# EAGLE design Diagnostic (EAGLE 9.5.0)

## Sheet 1 of 3: Microcontroller
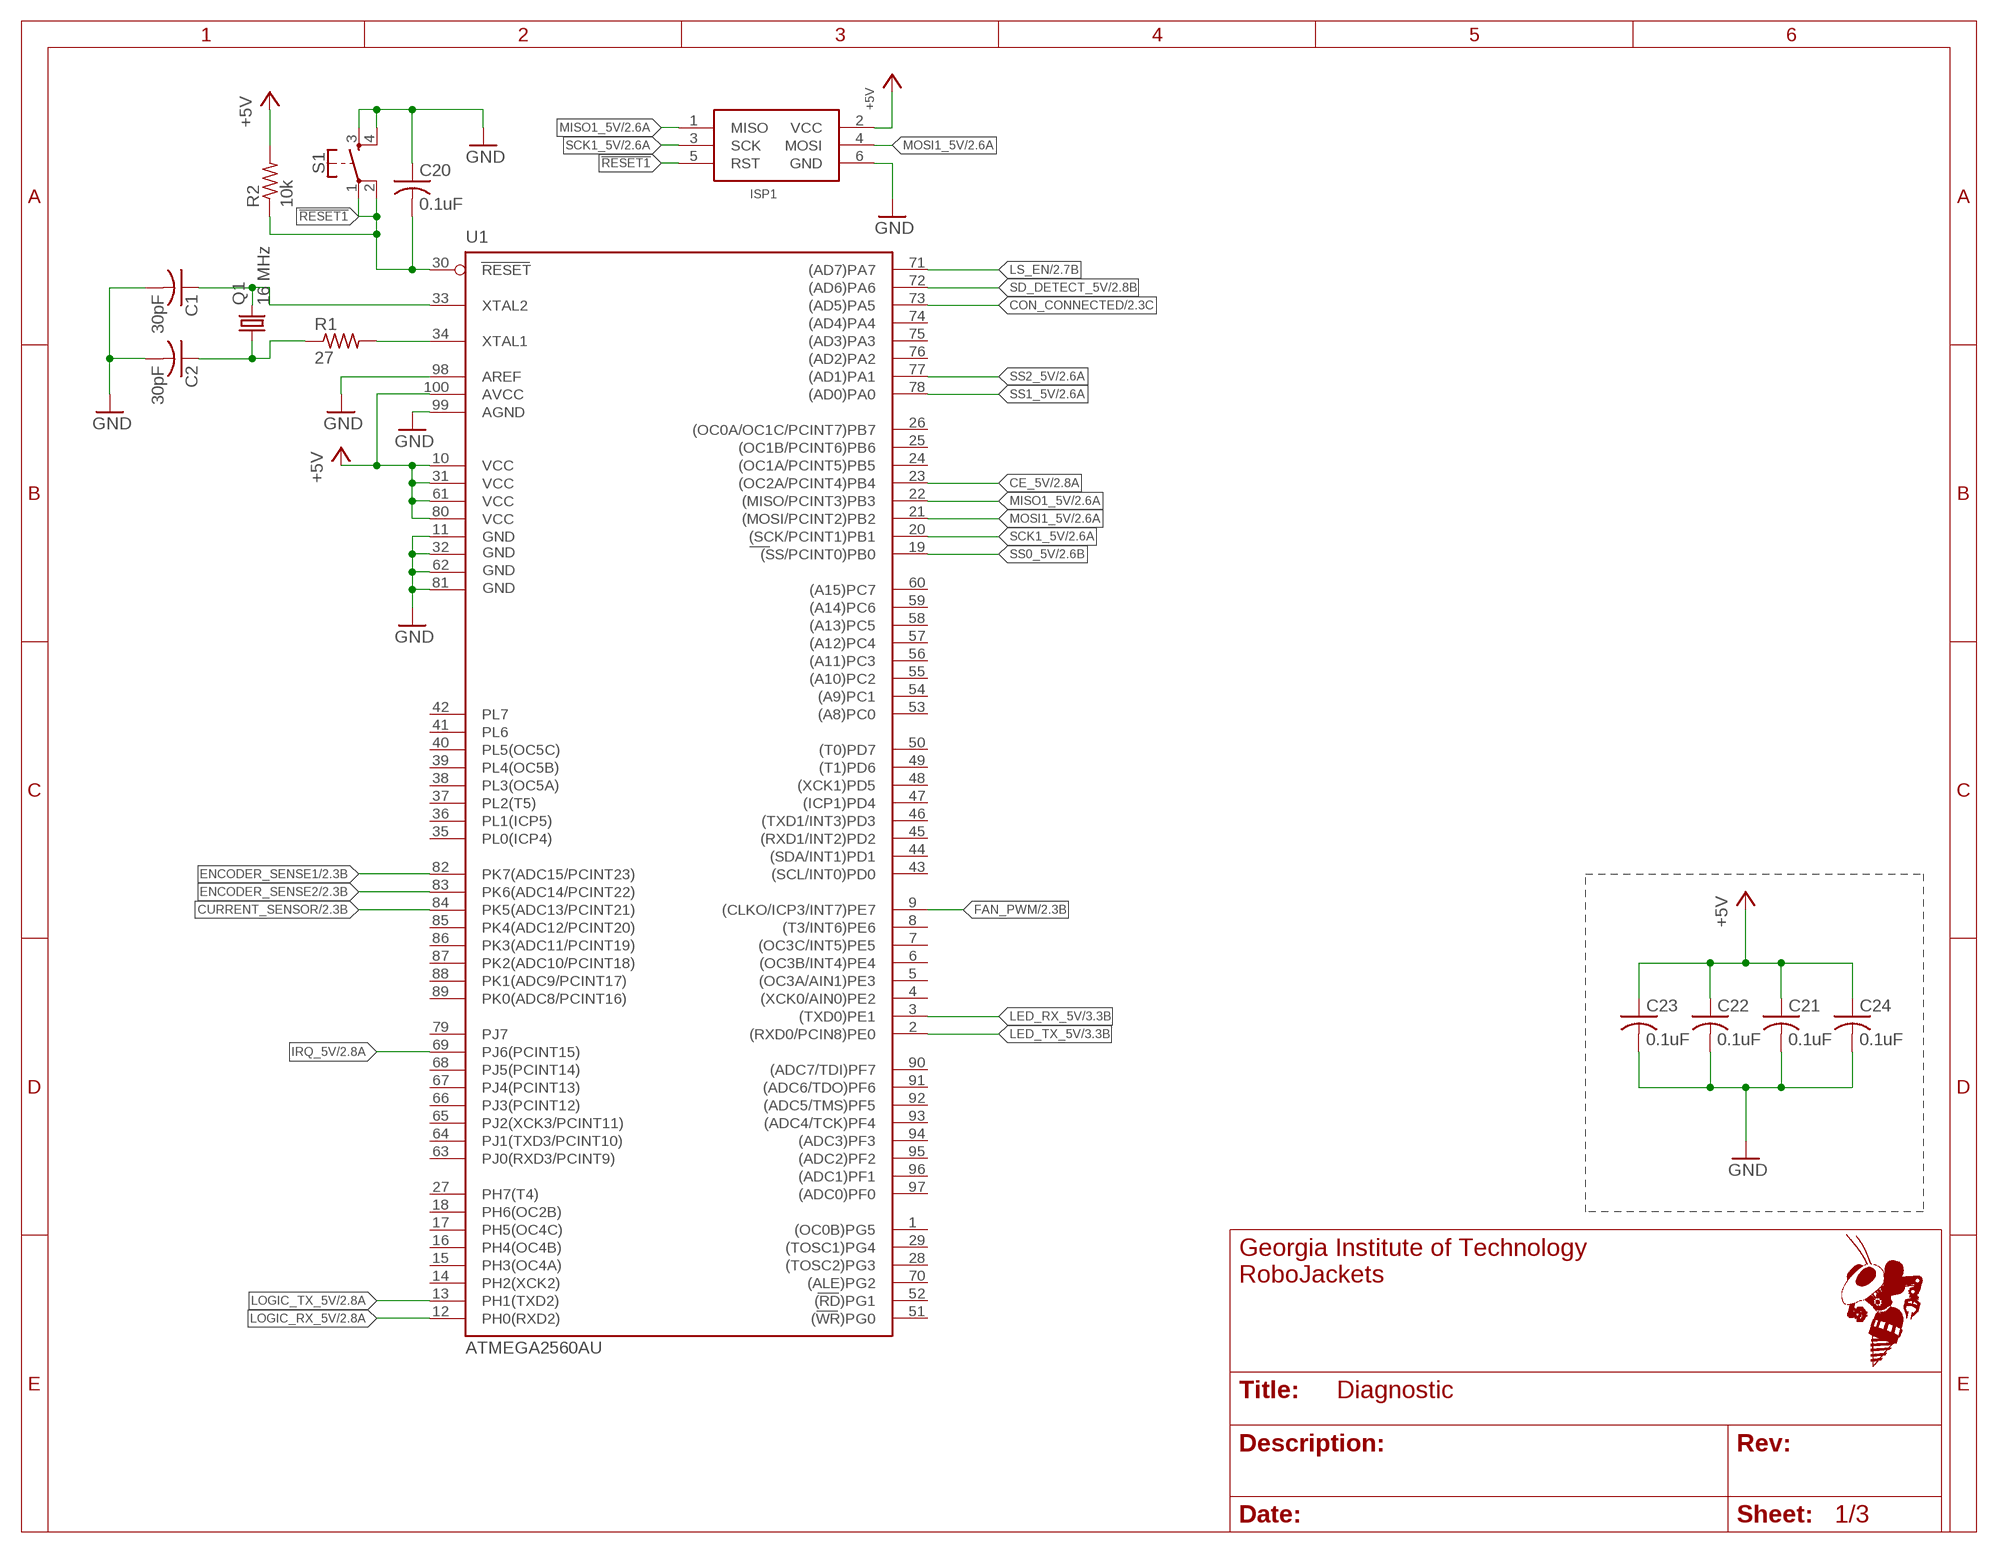
[diagram p0: schematic, sheet 1]

### Parts
C1  30pF  C-USC0603  [C0603]
C2  30pF  C-USC0603  [C0603]
C20  0.1uF  C-USC0603  [C0603]
C21  0.1uF  C-USC0603  [C0603]
C22  0.1uF  C-USC0603  [C0603]
C23  0.1uF  C-USC0603  [C0603]
C24  0.1uF  C-USC0603  [C0603]
ISP1  AVRISP-6  [AVRISP]
Q1  16 MHz  CRYSTALHC49UP  [HC49UP]
R1  27  R-US_R0603  [R0603]
R2  10k  R-US_R0603  [R0603]
S1  MOMENTARY-SWITCH-SPST-2-SMD-5.2MM  [TACTILE_SWITCH_SMD_5.2MM]
U1  ATMEGA2560AU  [TQFP100]

### Nets
!RESET1: C20.2 ISP1.5(RST) R2.1 S1.1 S1.2 U1.30(RESET)
+5V: C21.1 C22.1 C23.1 C24.1 ISP1.2(VCC) R2.2 U1.10(VCC) U1.31(VCC1) U1.61(VCC2) U1.80(VCC3) U1.100(AVCC) ; also sheet 2,3
CE_5V: U1.23((OC2A/PCINT4)PB4) ; also sheet 2
CON_CONNECTED: U1.73((AD5)PA5) ; also sheet 2
CURRENT_SENSOR: U1.84(PK5(ADC13/PCINT21)) ; also sheet 2
ENCODER_SENSE1: U1.82(PK7(ADC15/PCINT23)) ; also sheet 2
ENCODER_SENSE2: U1.83(PK6(ADC14/PCINT22)) ; also sheet 2
FAN_PWM: U1.9((CLKO/ICP3/INT7)PE7) ; also sheet 2
GND: C1.2 C2.2 C20.1 C21.2 C22.2 C23.2 C24.2 ISP1.6(GND) S1.3 S1.4 U1.11(GND) U1.32(GND1) U1.62(GND2) U1.81(GND3) U1.98(AREF) U1.99(AGND) ; also sheet 2,3
IRQ_5V: U1.69(PJ6(PCINT15)) ; also sheet 2
LED_RX_5V: U1.3((TXD0)PE1) ; also sheet 3
LED_TX_5V: U1.2((RXD0/PCIN8)PE0) ; also sheet 3
LOGIC_RX_5V: U1.12(PH0(RXD2)) ; also sheet 2
LOGIC_TX_5V: U1.13(PH1(TXD2)) ; also sheet 2
LS_EN: U1.71((AD7)PA7) ; also sheet 2
MISO1_5V: ISP1.1(MISO) U1.22((MISO/PCINT3)PB3) ; also sheet 2
MOSI1_5V: ISP1.4(MOSI) U1.21((MOSI/PCINT2)PB2) ; also sheet 2
N$1: C2.1 Q1.1 R1.1
N$2: C1.1 Q1.2 U1.33(XTAL2)
N$3: R1.2 U1.34(XTAL1)
SCK1_5V: ISP1.3(SCK) U1.20((SCK/PCINT1)PB1) ; also sheet 2
SD_DETECT_5V: U1.72((AD6)PA6) ; also sheet 2
SS0_5V: U1.19((SS/PCINT0)PB0) ; also sheet 2
SS1_5V: U1.78((AD0)PA0) ; also sheet 2
SS2_5V: U1.77((AD1)PA1) ; also sheet 2
Unconnected: U1.1((OC0B)PG5) U1.4((XCK0/AIN0)PE2) U1.5((OC3A/AIN1)PE3) U1.6((OC3B/INT4)PE4) U1.7((OC3C/INT5)PE5) U1.8((T3/INT6)PE6) U1.14(PH2(XCK2)) U1.15(PH3(OC4A)) U1.16(PH4(OC4B)) U1.17(PH5(OC4C)) U1.18(PH6(OC2B)) U1.24((OC1A/PCINT5)PB5) U1.25((OC1B/PCINT6)PB6) U1.26((OC0A/OC1C/PCINT7)PB7) U1.27(PH7(T4)) U1.28((TOSC2)PG3) U1.29((TOSC1)PG4) U1.35(PL0(ICP4)) U1.36(PL1(ICP5)) U1.37(PL2(T5)) U1.38(PL3(OC5A)) U1.39(PL4(OC5B)) U1.40(PL5(OC5C)) U1.41(PL6) U1.42(PL7) U1.43((SCL/INT0)PD0) U1.44((SDA/INT1)PD1) U1.45((RXD1/INT2)PD2) U1.46((TXD1/INT3)PD3) U1.47((ICP1)PD4) U1.48((XCK1)PD5) U1.49((T1)PD6) U1.50((T0)PD7) U1.51((WR)PG0) U1.52((RD)PG1) U1.53((A8)PC0) U1.54((A9)PC1) U1.55((A10)PC2) U1.56((A11)PC3) U1.57((A12)PC4) U1.58((A13)PC5) U1.59((A14)PC6) U1.60((A15)PC7) U1.63(PJ0(RXD3/PCINT9)) U1.64(PJ1(TXD3/PCINT10)) U1.65(PJ2(XCK3/PCINT11)) U1.66(PJ3(PCINT12)) U1.67(PJ4(PCINT13)) U1.68(PJ5(PCINT14)) U1.70((ALE)PG2) U1.74((AD4)PA4) U1.75((AD3)PA3) U1.76((AD2)PA2) U1.79(PJ7) U1.85(PK4(ADC12/PCINT20)) U1.86(PK3(ADC11/PCINT19)) U1.87(PK2(ADC10/PCINT18)) U1.88(PK1(ADC9/PCINT17)) U1.89(PK0(ADC8/PCINT16)) U1.90((ADC7/TDI)PF7) U1.91((ADC6/TDO)PF6) U1.92((ADC5/TMS)PF5) U1.93((ADC4/TCK)PF4) U1.94((ADC3)PF3) U1.95((ADC2)PF2) U1.96((ADC1)PF1) U1.97((ADC0)PF0)

## Sheet 2 of 3: Connectors
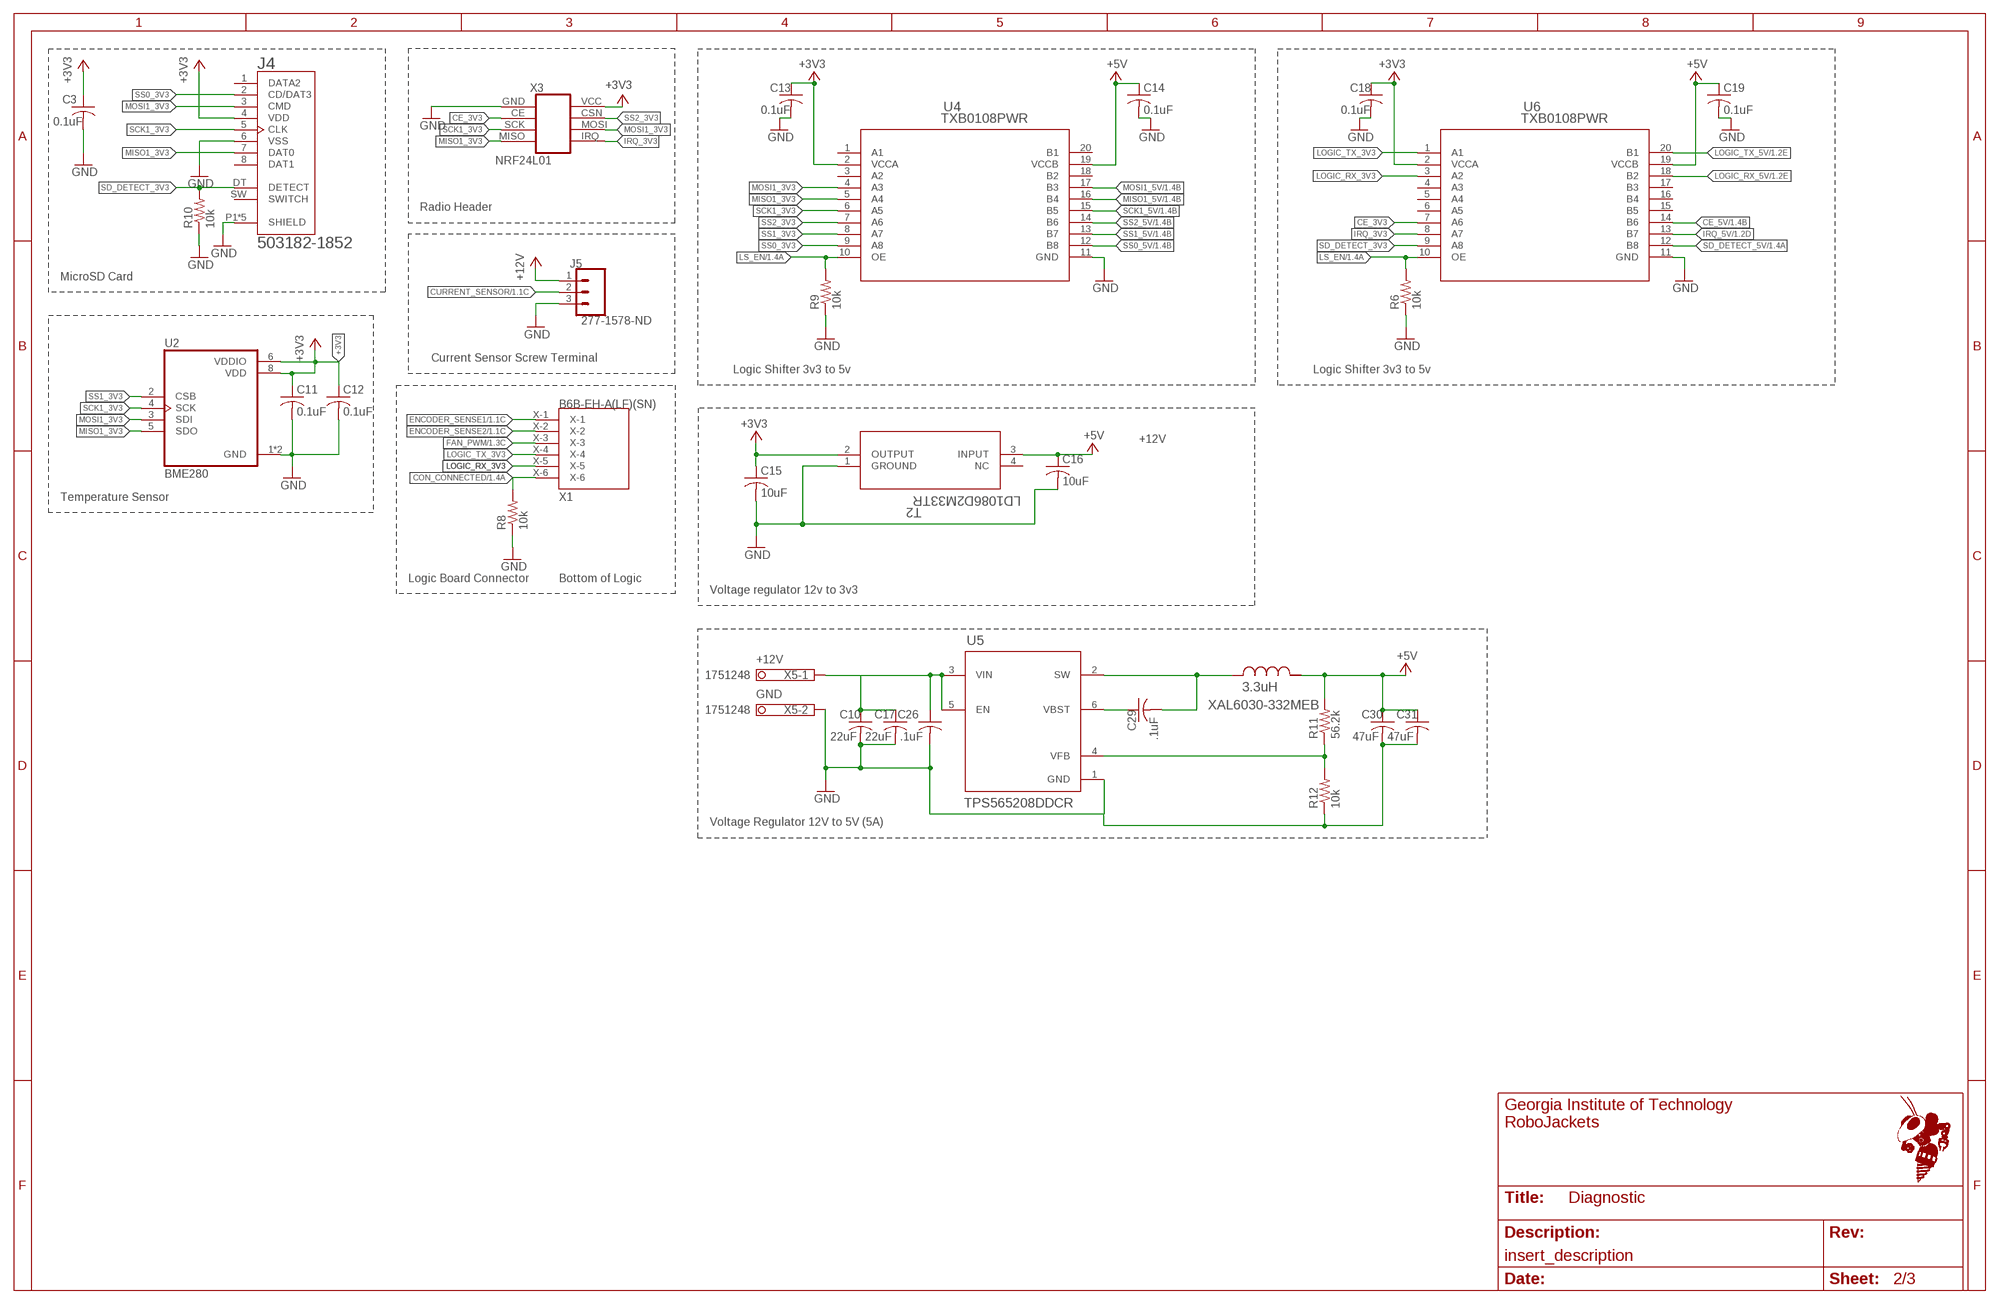
[diagram p1: schematic, sheet 2]
FRAME4 (FRAME_B_L): SCH_DESC: insert_description

### Parts
C3  0.1uF  C-USC0603  [C0603]
C10  22uF  C-USC0603  [C0603]
C11  0.1uF  C-USC0603  [C0603]
C12  0.1uF  C-USC0603  [C0603]
C13  0.1uF  C-USC0603  [C0603]
C14  0.1uF  C-USC0603  [C0603]
C15  10uF  C-USC1206  [C1206]
C16  10uF  C-USC1206  [C1206]
C17  22uF  C-USC0603  [C0603]
C18  0.1uF  C-USC0603  [C0603]
C19  0.1uF  C-USC0603  [C0603]
C26  .1uF  C-USC0603  [C0603]
C29  .1uF  C-USC0603  [C0603]
C30  47uF  C-USC0603  [C0603]
C31  47uF  C-USC0603  [C0603]
J4  503182-1852  [MOLEX_503182-1852]
J5  277-1578-ND  CONN_03-SCREW-5MM  [SCREWTERMINAL-5MM-3]
R6  10k  R-US_R0603  [R0603]
R8  10k  R-US_R0603  [R0603]
R9  10k  R-US_R0603  [R0603]
R10  10k  R-US_R0603  [R0603]
R11  56.2k  R-US_R0603  [R0603]
R12  10k  R-US_R0603  [R0603]
T2  LD1086D2M33TR  [D2PAK/A]
U2  BME280  [PSON65P250X250X100-8N]
U4  TXB0108PWR  [PW20]
U5  TPS565208DDCR  [DDC0006A_N]
U6  TXB0108PWR  [PW20]
X1  B6B-EH-A(LF)(SN)  [B6BEHALFSN]
X3  NRF24L01  NRF24L01+PA+LNA  [NRF24L01+PA+LNA]
X5  1751248  [1751248]
XAL6030-332MEB  3.3uH  XAL6030-332MEB  [XAL6030]

### Nets
+3.3V: X3.VCC ; supply symbol labelled +3V3
+3V3: C3.1 C11.1 C12.1 C13.1 C15.1 C18.1 J4.4(VDD) T2.2(OUTPUT) U2.6(VDDIO) U2.8(VDD) U4.2(VCCA) U6.2(VCCA)
+5V: C14.1 C16.1 C19.1 C30.1 C31.1 R11.2 T2.3(INPUT) U4.19(VCCB) U6.19(VCCB) XAL6030-332MEB.2 ; also sheet 1,3
+12V: C10.1 C17.1 C26.1 J5.1 U5.3(VIN) U5.5(EN) X5.1
CE_3V3: U6.7(A6) X3.CE
CE_5V: U6.14(B6) ; also sheet 1
CON_CONNECTED: R8.2 X1.X-6 ; also sheet 1
CURRENT_SENSOR: J5.2 ; also sheet 1
ENCODER_SENSE1: X1.X-1 ; also sheet 1
ENCODER_SENSE2: X1.X-2 ; also sheet 1
FAN_PWM: X1.X-3 ; also sheet 1
GND: C3.2 C10.2 C11.2 C12.2 C13.2 C14.2 C15.2 C16.2 C17.2 C18.2 C19.2 C26.2 C30.2 C31.2 J4.6(VSS) J4.P1(SHIELD) J4.P2(SHIELD) J4.P3(SHIELD) J4.P4(SHIELD) J4.P5(SHIELD) J5.3 R6.1 R8.1 R9.1 R10.1 R12.1 T2.1(GROUND) U2.1(GND) U2.7(GND) U4.11(GND) U5.1(GND) U6.11(GND) X3.GND X5.2 ; also sheet 1,3
IRQ_3V3: U6.8(A7) X3.IRQ
IRQ_5V: U6.13(B7) ; also sheet 1
LOGIC_RX_3V3: U6.3(A2) X1.X-5
LOGIC_RX_5V: U6.18(B2) ; also sheet 1
LOGIC_TX_3V3: U6.1(A1) X1.X-4
LOGIC_TX_5V: U6.20(B1) ; also sheet 1
LS_EN: R6.2 R9.2 U4.10(OE) U6.10(OE) ; also sheet 1
MISO1_3V3: J4.7(DAT0) U2.5(SDO) U4.5(A4) X3.MISO
MISO1_5V: U4.16(B4) ; also sheet 1
MOSI1_3V3: J4.3(CMD) U2.3(SDI) U4.4(A3) X3.MOSI
MOSI1_5V: U4.17(B3) ; also sheet 1
N$7: C29.2 U5.2(SW) XAL6030-332MEB.1
N$8: C29.1 U5.6(VBST)
N$9: R11.1 R12.2 U5.4(VFB)
SCK1_3V3: J4.5(CLK) U2.4(SCK) U4.6(A5) X3.SCK
SCK1_5V: U4.15(B5) ; also sheet 1
SD_DETECT_3V3: J4.DT(DETECT) R10.2 U6.9(A8)
SD_DETECT_5V: U6.12(B8) ; also sheet 1
SS0_3V3: J4.2(CD/DAT3) U4.9(A8)
SS0_5V: U4.12(B8) ; also sheet 1
SS1_3V3: U2.2(CSB) U4.8(A7)
SS1_5V: U4.13(B7) ; also sheet 1
SS2_3V3: U4.7(A6) X3.CSN
SS2_5V: U4.14(B6) ; also sheet 1
Unconnected: J4.1(DATA2) J4.8(DAT1) J4.SW(SWITCH) T2.4(NC) U4.1(A1) U4.3(A2) U4.18(B2) U4.20(B1) U6.4(A3) U6.5(A4) U6.6(A5) U6.15(B5) U6.16(B4) U6.17(B3)

### Notes on the sheet
- Radio Header
- MicroSD Card
- Current Sensor Screw Terminal
- Logic Shifter 3v3 to 5v | Logic Shifter 3v3 to 5v
- +12V
- Temperature Sensor
- Logic Board Connector | Bottom of Logic
- Voltage regulator 12v to 3v3
- +12V
- GND
- Voltage Regulator 12V to 5V (5A)

## Sheet 3 of 3: Neopixel
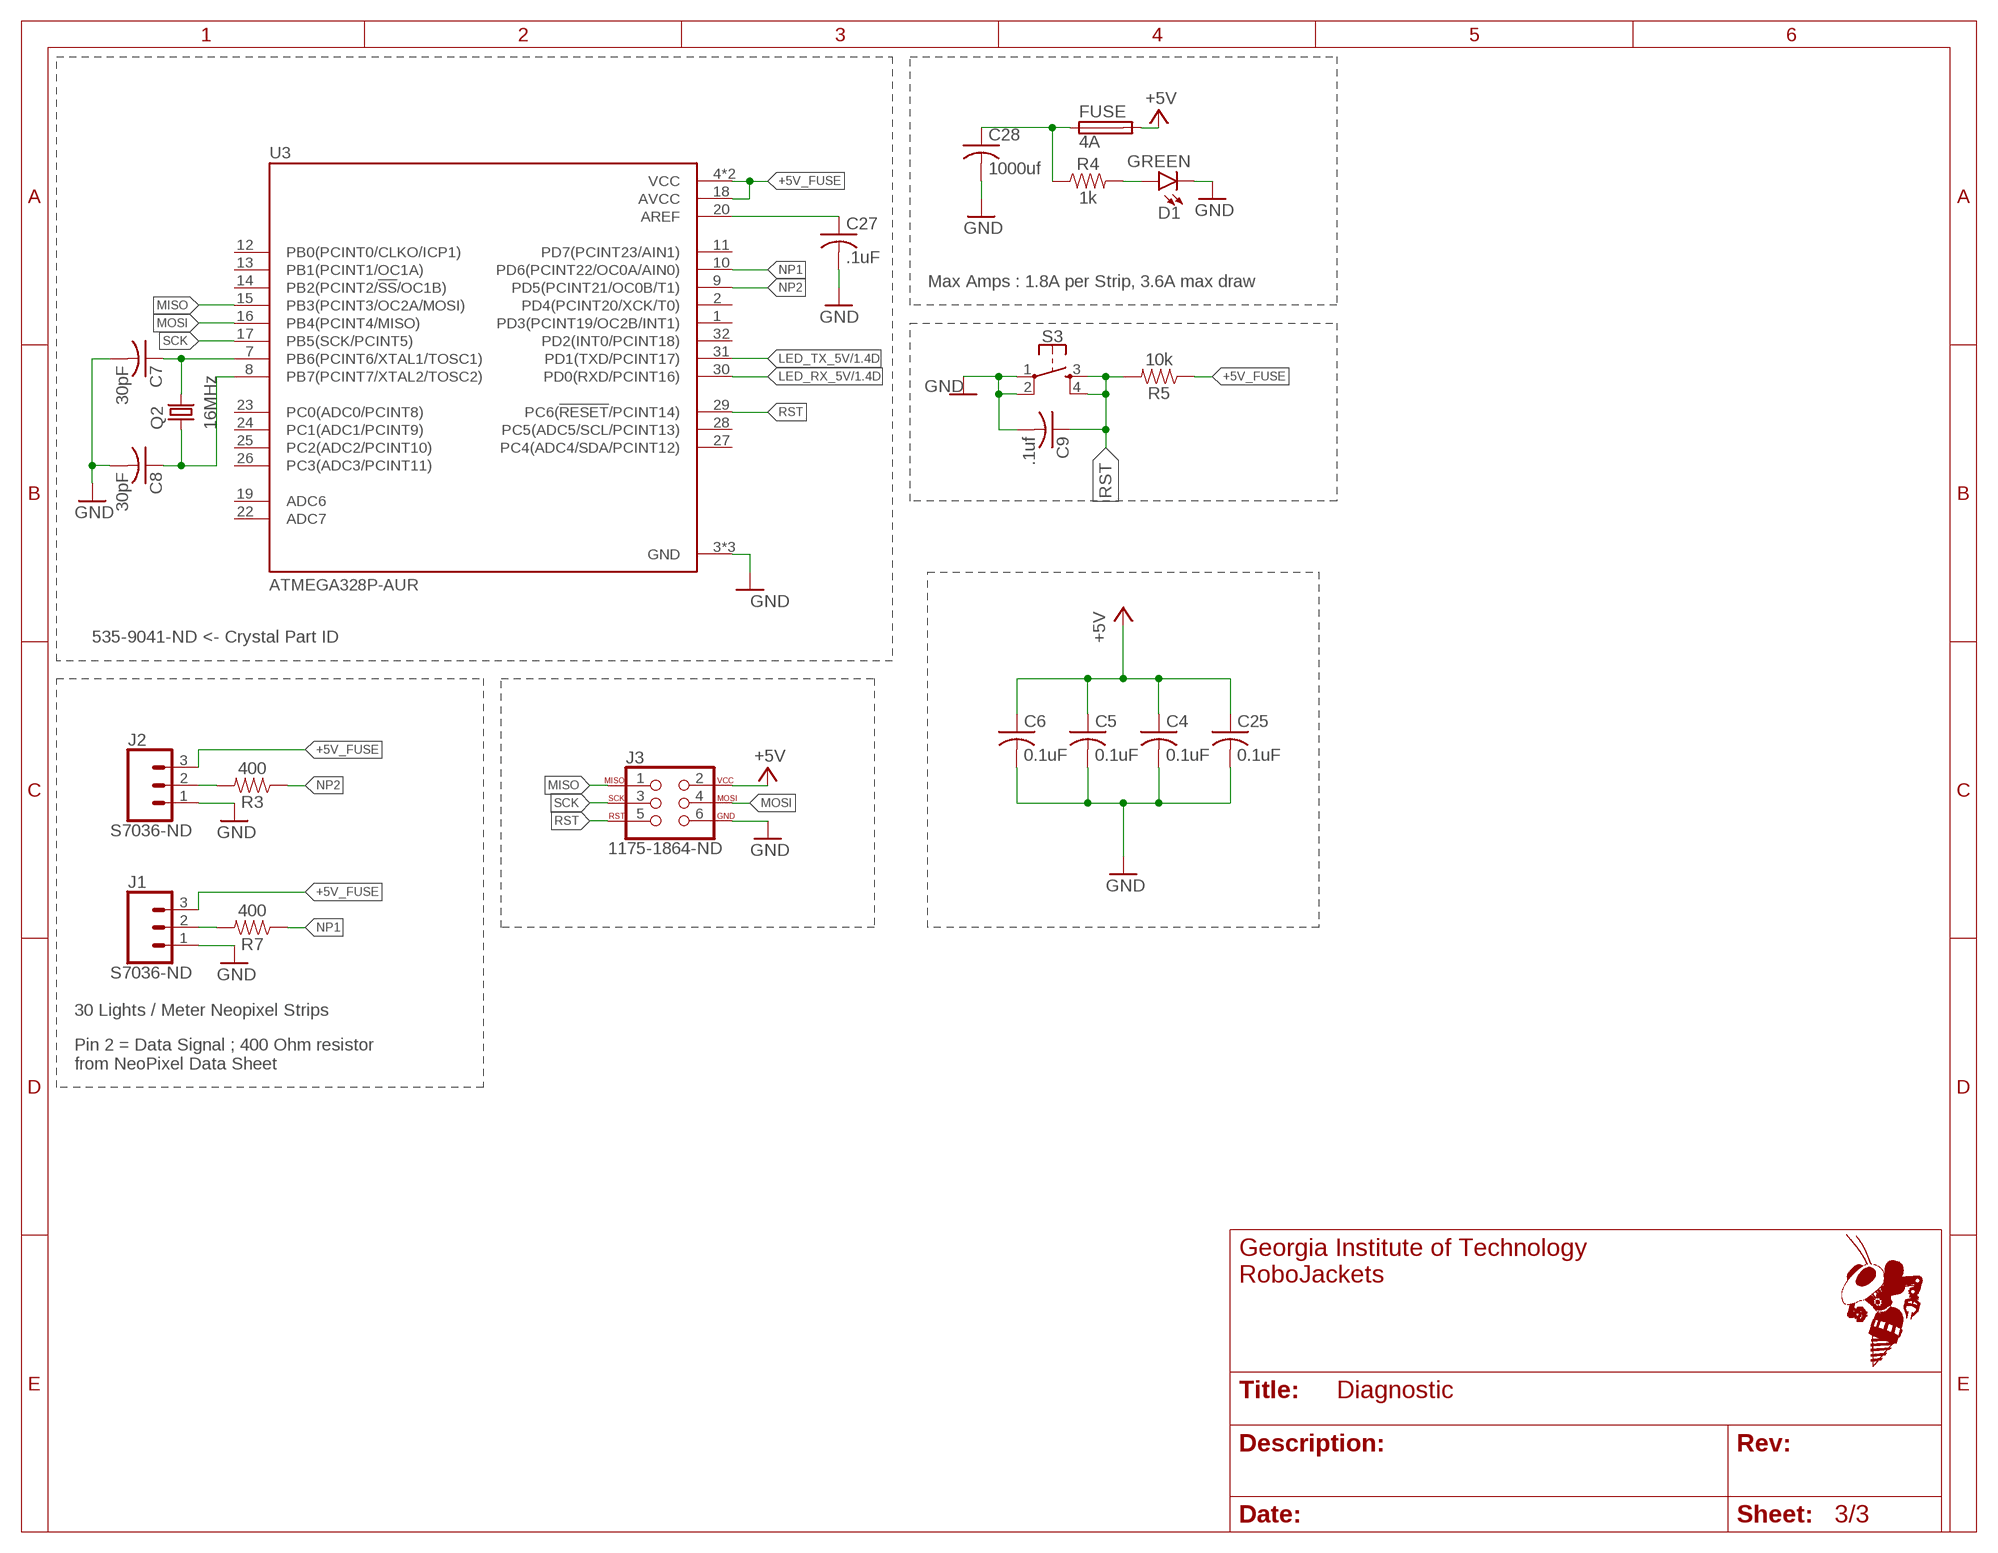
[diagram p2: schematic, sheet 3]

### Parts
C4  0.1uF  C-USC0603  [C0603]
C5  0.1uF  C-USC0603  [C0603]
C6  0.1uF  C-USC0603  [C0603]
C7  30pF  C-USC0603  [C0603]
C8  30pF  C-USC0603  [C0603]
C9  .1uf  C-USC0603  [C0603]
C25  0.1uF  C-USC0603  [C0603]
C27  .1uF  C-USC0603  [C0603]
C28  1000uf  C-USC0603  [C0603]
D1  GREEN  LED-GREEN0603  [LED-0603]
FUSE  4A  FUSE_HOLDER  [FUSE_HOLDER]
J1  S7036-ND  CONN_03  [1X03]
J2  S7036-ND  CONN_03  [1X03]
J3  1175-1864-ND  AVR_SPI_PROG_3X2NS  [2X3-NS]
Q2  16MHz  CRYSTALHC49S  [HC49/S]
R3  400  470OHM-0603-1/10W-1%  [0603]
R4  1k  470OHM-0603-1/10W-1%  [0603]
R5  10k  470OHM-0603-1/10W-1%  [0603]
R7  400  470OHM-0603-1/10W-1%  [0603]
S3  MOMENTARY-SWITCH-SPST-2-SMD-5.2MM  [TACTILE_SWITCH_SMD_5.2MM]
U3  ATMEGA328P-AUR  [QFP32P80_900X900X120L60X37N]

### Nets
+5V: C4.1 C5.1 C6.1 C25.1 FUSE.P$3 FUSE.P$4 J3.2 ; also sheet 1,2
+5V_FUSE: C28.1 FUSE.P$1 FUSE.P$2 J1.3 J2.3 R4.1 R5.1 U3.4(VCC) U3.6(VCC) U3.18(AVCC)
DATA3: J2.2 R3.2
DATA4: J1.2 R7.2
GND: C4.2 C5.2 C6.2 C7.2 C8.2 C9.2 C25.2 C27.2 C28.2 D1.C J1.1 J2.1 J3.6 S3.1 S3.2 U3.3(GND) U3.5(GND) U3.21(GND) ; also sheet 1,2
LED_RX_5V: U3.30(PD0(RXD/PCINT16)) ; also sheet 1
LED_TX_5V: U3.31(PD1(TXD/PCINT17)) ; also sheet 1
MISO: J3.1 U3.15(PB3(PCINT3/OC2A/MOSI))
MOSI: J3.4 U3.16(PB4(PCINT4/MISO))
N$4: D1.A R4.2
N$23: C27.1 U3.20(AREF)
NP1: R7.1 U3.10(PD6(PCINT22/OC0A/AIN0))
NP2: R3.1 U3.9(PD5(PCINT21/OC0B/T1))
RST: C9.1 J3.5 R5.2 S3.3 S3.4 U3.29(PC6(!RESET!/PCINT14))
SCK: J3.3 U3.17(PB5(SCK/PCINT5))
XTAL3: C7.1 Q2.2 U3.7(PB6(PCINT6/XTAL1/TOSC1))
XTAL4: C8.1 Q2.1 U3.8(PB7(PCINT7/XTAL2/TOSC2))
Unconnected: U3.1(PD3(PCINT19/OC2B/INT1)) U3.2(PD4(PCINT20/XCK/T0)) U3.11(PD7(PCINT23/AIN1)) U3.12(PB0(PCINT0/CLKO/ICP1)) U3.13(PB1(PCINT1/OC1A)) U3.14(PB2(PCINT2/!SS!/OC1B)) U3.19(ADC6) U3.22(ADC7) U3.23(PC0(ADC0/PCINT8)) U3.24(PC1(ADC1/PCINT9)) U3.25(PC2(ADC2/PCINT10)) U3.26(PC3(ADC3/PCINT11)) U3.27(PC4(ADC4/SDA/PCINT12)) U3.28(PC5(ADC5/SCL/PCINT13)) U3.32(PD2(INT0/PCINT18))

### Notes on the sheet
- Max Amps : 1.8A per Strip, 3.6A max draw
- 535-9041-ND <- Crystal Part ID
- 30 Lights / Meter Neopixel Strips
- Pin 2 = Data Signal ; 400 Ohm resistor 
  from NeoPixel Data Sheet

## Library data of the parts
C1-C31 = rcl:C-US: CAPACITOR, American symbol; SPICEPREFIX: C
D1 = SparkFun-LED:LED-GREEN: Green SMD LED Used in manufacturing of various products at SparkFun Packages: 0603 - SMD 0603 package [Product Link] <http://www.futureelectronics.com/en/technologies/semiconductors/optoelectronics/leds/Pages/9894312-LTST-C190GKT.aspx?CrossPart=HSMG-C190&IM=0> LilyPad 1206 - SMD1206 LilyPad package [Product Link] <http://www.futureelectronics.com/en/Technologies/Product.aspx?ProductID=IN150NGHARVATEKCORPORATION2049943&IM=0> 1206 - SMD1206 package [Product Link] <http://www.futureelectronics.com/en/technologies/semiconductors/optoelectronics/leds/Pages/8315665-LTST-C150KGKT.aspx?IM=0> 1206 Bottom Mount -SMD 1206 Bottom Mount [Product Link] <http://www.digikey.com/product-detail/en/lite-on-inc/LTST-C230KGKT/160-1456-1-ND/386854> SparkFun Products: Pro Mini 328 -5V <https://www.sparkfun.com/products/821> RedBoard <https://www.sparkfun.com/products/12757> MP3 Trigger <https://www.sparkfun.com/products/13720> Makey Makey <https://www.sparkfun.com/products/11076>; PROD_ID: DIO-00821
FUSE = IGVC-Misc:FUSE_HOLDER
ISP1 = adafruit:AVRISP: AVR ISP HEADER Standard 6 pin header for AVR programming
J1 J2 = SparkFun-Connectors:CONN_03: Multi connection point. Often used as Generic Header-pin footprint for 0.1 inch spaced/style header connections On any of the 0.1 inch spaced packages, you can populate with these: Break Away Headers - Straight <https://www.sparkfun.com/products/116> (PRT-00116) Break Away Male Headers - Right Angle <https://www.sparkfun.com/products/553> (PRT-00553) Female Headers <https://www.sparkfun.com/products/115> (PRT-00115) Break Away Headers - Machine Pin <https://www.sparkfun.com/products/117> (PRT-00117) Break Away Female Headers - Swiss Machine Pin <https://www.sparkfun.com/products/743> (PRT-00743) Stackable Header - 3 Pin (Female, 0.1") <https://www.sparkfun.com/products/13875> (PRT-13875) For SCREWTERMINALS and SPRING TERMINALS visit here: Screw Terimnals on SparkFun.com <https://www.sparkfun.com/search/results?term=Screw+Terminals> (5mm/3.5mm/2.54mm spacing) This device is also useful as a general connection point to wire up your design to another part of your project. Our various solder wires solder well into these plated through hole pads. Hook-Up Wire - Assortment (Stranded, 22 AWG) <https://www.sparkfun.com/products/11375> (PRT-11375) Hook-Up Wire - Assortment (Solid Core, 22 AWG) <https://www.sparkfun.com/products/11367> (PRT-11367) View the entire wire category on our website here <https://www.sparkfun.com/categories/141> Special notes: Molex polarized connector foot print use with SKU : PRT-08232 with associated crimp pins and housings.; SPICEPREFIX: J
J3 = SparkFun-Connectors:AVR_SPI_PROG_3X2: AVR ISP 6 Pin This is the reduced ISP connector for AVR programming. Common on Arduino. This footprint will take up less PCB space and can be used with a 10-pin to 6-pin adapter such as SKU: BOB-08508 **Special note about "TEST_POINT" package. The stop mask is on the top side, so if you want your programming test points to be on the bottom of your board, make sure to place this package on the bottom side of the board. This also ensure that the orientation to program from the bottom side will be correct. SparkFun Products: SparkFun ISP Pogo Adapter <https://www.sparkfun.com/products/11591> - NS Tiny AVR Programmer <https://www.sparkfun.com/products/11801> -PTH
J4 = 503182-1852:503182-1852: Conn Micro SD Card M 8 POS 1.09mm Solder RA SMD Embossed T/R 0.5A/Contact; AVAILABILITY: Unavailable; DESCRIPTION: MICRO SD NORMAL ULTRALOWPRO8CKTE; MF: Molex; MP: 5031821852; PACKAGE: None; PRICE: None
J5 = SparkFun-Connectors:CONN_03: Multi connection point. Often used as Generic Header-pin footprint for 0.1 inch spaced/style header connections On any of the 0.1 inch spaced packages, you can populate with these: Break Away Headers - Straight <https://www.sparkfun.com/products/116> (PRT-00116) Break Away Male Headers - Right Angle <https://www.sparkfun.com/products/553> (PRT-00553) Female Headers <https://www.sparkfun.com/products/115> (PRT-00115) Break Away Headers - Machine Pin <https://www.sparkfun.com/products/117> (PRT-00117) Break Away Female Headers - Swiss Machine Pin <https://www.sparkfun.com/products/743> (PRT-00743) Stackable Header - 3 Pin (Female, 0.1") <https://www.sparkfun.com/products/13875> (PRT-13875) For SCREWTERMINALS and SPRING TERMINALS visit here: Screw Terimnals on SparkFun.com <https://www.sparkfun.com/search/results?term=Screw+Terminals> (5mm/3.5mm/2.54mm spacing) This device is also useful as a general connection point to wire up your design to another part of your project. Our various solder wires solder well into these plated through hole pads. Hook-Up Wire - Assortment (Stranded, 22 AWG) <https://www.sparkfun.com/products/11375> (PRT-11375) Hook-Up Wire - Assortment (Solid Core, 22 AWG) <https://www.sparkfun.com/products/11367> (PRT-11367) View the entire wire category on our website here <https://www.sparkfun.com/categories/141> Special notes: Molex polarized connector foot print use with SKU : PRT-08232 with associated crimp pins and housings.; PROD_ID: CONN-10134; SF_SKU: PRT-08433
Q1 = adafruit:CRYSTAL: CRYSTAL; OC_FARNELL: unknown; OC_NEWARK: unknown
Q2 = crystal:CRYSTAL: CRYSTAL; OC_FARNELL: 1667008; OC_NEWARK: unknown
R1 R2 R6 R8-R12 = rcl:R-US_: RESISTOR, American symbol; SPICEPREFIX: R
R3-R5 R7 = SparkFun-Resistors:470OHM: 470Ω resistor A resistor is a passive two-terminal electrical component that implements electrical resistance as a circuit element. Resistors act to reduce current flow, and, at the same time, act to lower voltage levels within circuits. - Wikipedia; PROD_ID: RES-07869; VALUE: 470
S1 S3 = SparkFun-Switches:MOMENTARY-SWITCH-SPST-2: Momentary Switch (Pushbutton) - SPST - Two Circuits Normally-open (NO) SPST momentary switches (buttons, pushbuttons). Schematic symbol includes two switch circuits. Variants SMD-4.6MMX2.8MM - 4.60mm x 2.80mm Tactile Momentary Button Switch - Used on SparkFun SAMD21 Mini Breakout <https://www.sparkfun.com/products/13664> SMD-5.2MM - Mini Pushbutton Switch - SMD <https://www.sparkfun.com/products/8720> - Used on Arduino Pro Mini <https://www.sparkfun.com/products/11114>; PROD_ID: SWCH-08247; SF_SKU: COM-08720
T2 = transistor:LD1086D2M33TR; MANUFACTURER_PART_NUMBER: LD1086D2M33TR; VENDOR: STMicroelectronics
U1 = SparkFun-IC-Microcontroller:ATMEGA2560: Atmel 100-pin 8-bit uC 64/128/256 Kbytes FLASH 4 Kbytes EEPROM 8 Kbytes SRAM 86 General Purpose I/O pins 12-channels16-bit PWM 4 x Serial USARTs 16-channels 10-bit A/D SparkFun Products None.; PROD_ID: IC-10040
U2 = BME280:BME280: DIGITAL HUMIDITY, PRESSURE AND TEMPERATURE SENSOR * Digital interface I²C (up to 3.4 MHz) and SPI (3 and 4 wire, up to 10 MHz)* Supply voltage VDD main supply voltage range: 1.71 V to 3.6 V*VDDIO interface voltage range: 1.2 V to 3.6 V Operating range -40…+85 °C, 0…100 % rel. humidity, 300…1100 hPa The library has been designed by Richard Magdycz <https://www.facebook.com/groups/eaglecadsoftUK>; DESCRIPTION: Integrated pressure, humidity and temperature sensor; 8-pin 2.5x2.5x0.93mm LGA; DIGI-KEY_PART_NUMBER: 828-1063-1-ND; DIGI-KEY_PURCHASE_URL: https://www.digikey.com/product-detail/en/bosch-sensortec/BME280/828-1063-1-ND/6136314?utm_source=snapeda&utm_medium=aggregator&utm_campaign=symbol; MF: Bosch; MP: BME280; PACKAGE: LGA-8 Bosch
U3 = ATMEGA328P-AUR:ATMEGA328P-AUR: ATmega328P Series 8 Bit 2 kB RAM 32 kB Flash SMT Microcontroller - TQFP-32; DESCRIPTION: ATmega328P Series 8 Bit 2 kB RAM 32 kB Flash SMT Microcontroller - TQFP-32; DIGI-KEY_PART_NUMBER: ATMEGA328P-AURCT-ND; DIGI-KEY_PURCHASE_URL: https://www.digikey.com/product-detail/en/microchip-technology/ATMEGA328P-AUR/ATMEGA328P-AURCT-ND/3789455?utm_source=snapeda&utm_medium=aggregator&utm_campaign=symbol; MF: Microchip; MP: ATMEGA328P-AUR; PACKAGE: TQFP-32 Microchip
U4 U6 = 296-21527-1-ND:TXB0108PWR; MANUFACTURER_PART_NUMBER: TXB0108PWR; VENDOR: Texas Instruments
U5 = TPS565208DDCR:TPS565208DDCR; MANUFACTURER: Texas Instruments; MANUFACTURER_NAME: Texas Instruments; MANUFACTURER_PART_NUMBER: TPS565208DDCR; PARTNUMBER: TPS565208DDCR; REFDES: RefDes; TYPE: TYPE; VALUE: Value
X1 = IGVC-Connector:B6B-EH-A(LF)(SN)
X3 = IGVC-Connector:NRF24L01+PA+LNA: NRF24L01+PA+LNA
X5 = con-phoenix-350:1751248: MKDS 1/ 2-3,5 Printklemme Nennstrom: 10 A Bemessungsspannung: 160 V Raster: 3,5 mm Polzahl: 2 Montageart: Löten Anschlussart: Schraubanschluss Anschlussrichtung vom Leiter zur Platine: 0° Source: http://eshop.phoenixcontact.com .. 1751248.pdf; OC_FARNELL: unknown; OC_NEWARK: unknown
XAL6030-332MEB = TPS565208DDCR:XAL6030-332MEB; DCR: 0.02; IDC: 9.8; L: 3.3E6; MANUFACTURER_NAME: Coilcraft; MANUFACTURER_PART_NUMBER: XAL6030332MEB; VENDOR: Coilcraft

## Board
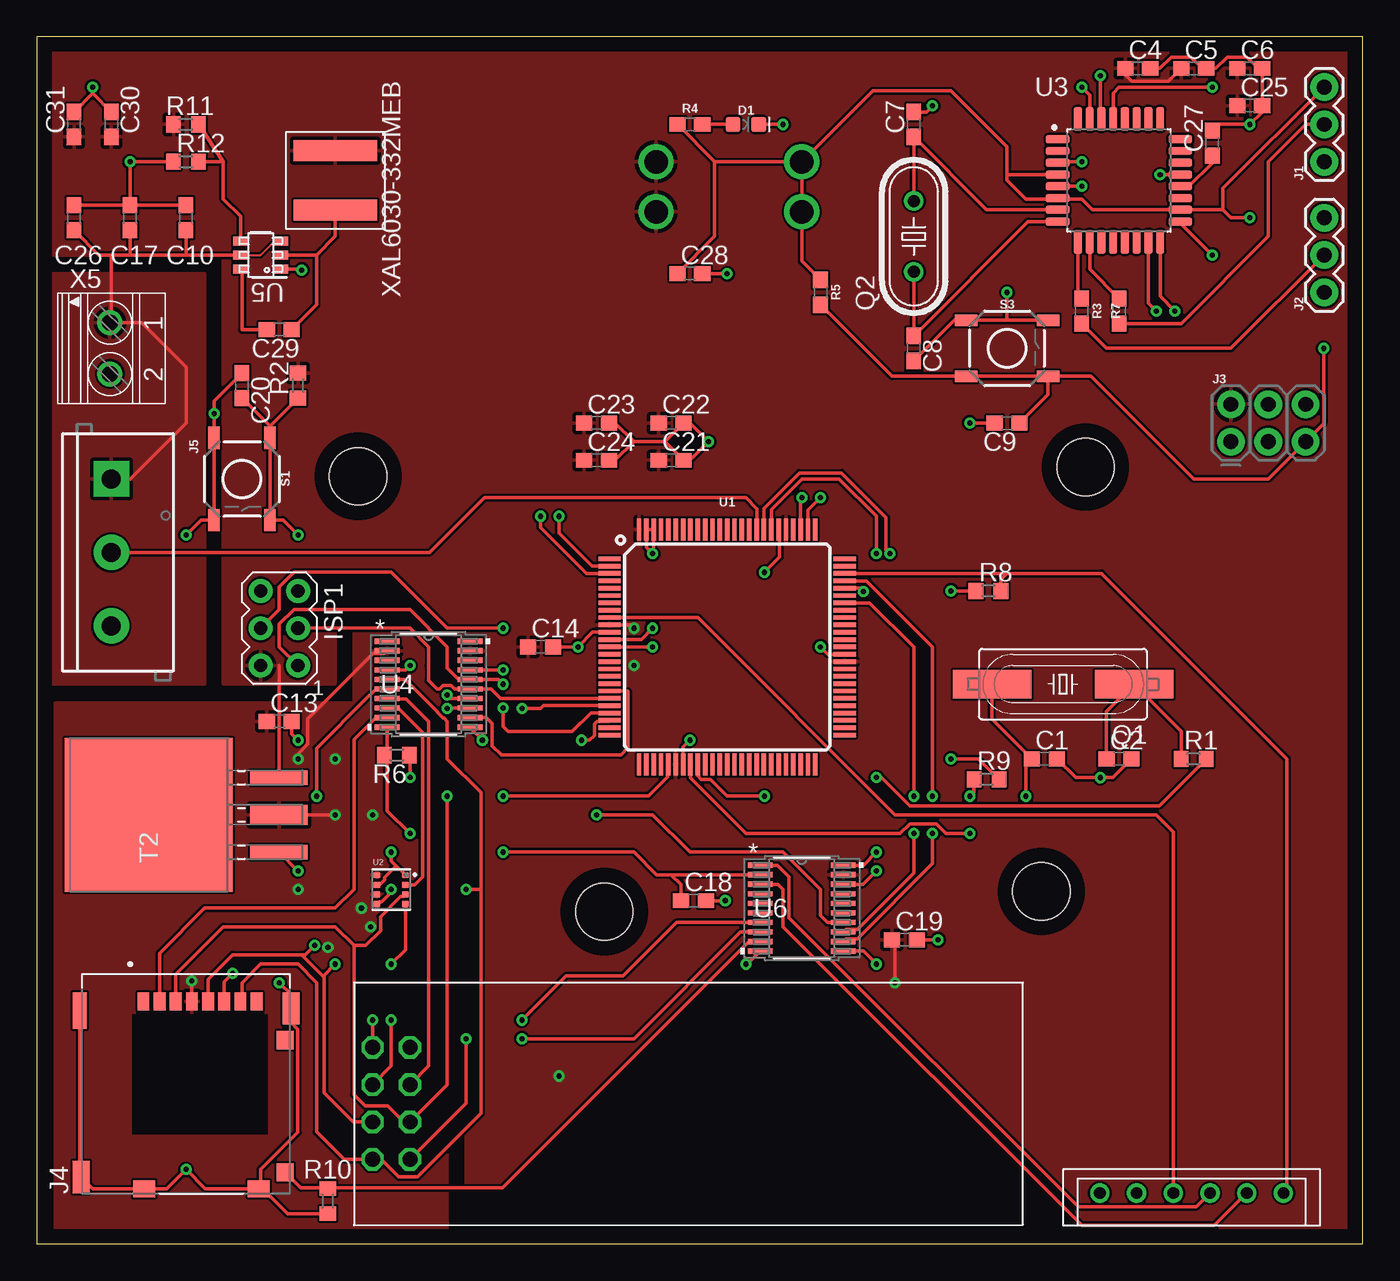
[diagram p3: board, top side]
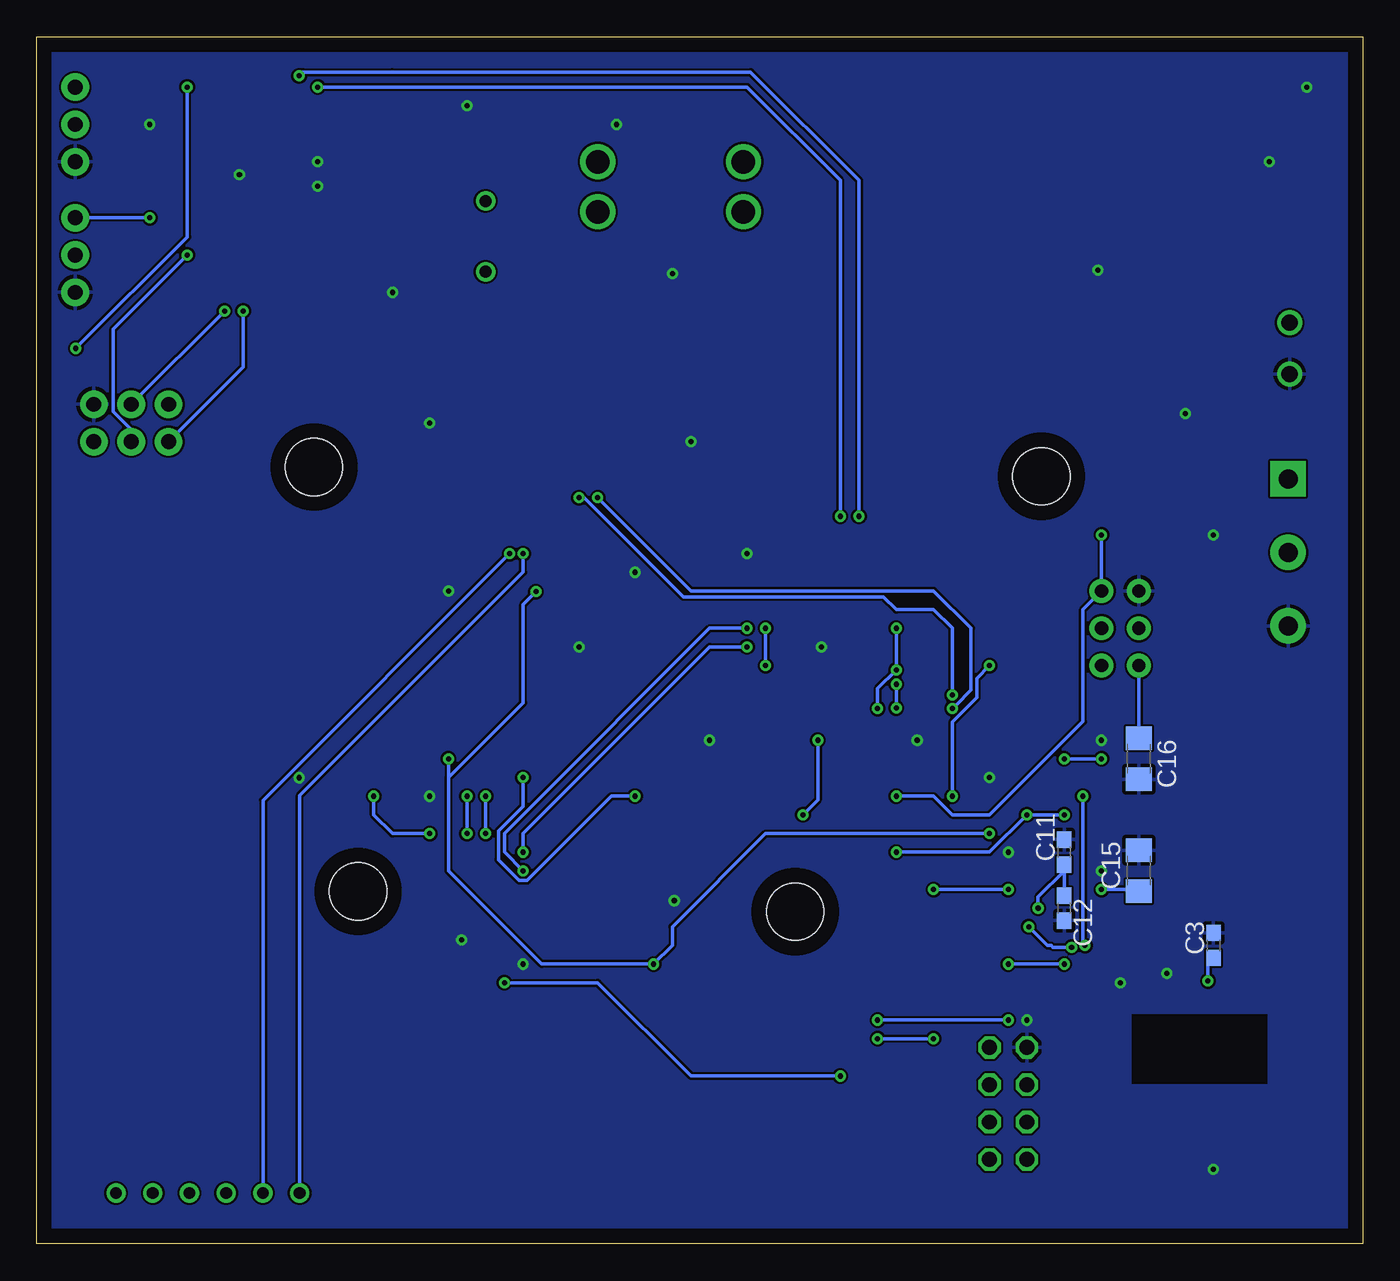
[diagram p4: board, bottom side, seen from below]

Size 90.25 x 82.17 mm. Coordinates in mm from the lower left corner, seen from the top.
Outline: 0,0 90.25,0 90.25,82.17 0,82.17 0,0
Copper layers (1*16): Top 0.035mm / dielectric 1.5mm / Bottom 0.035mm
Design rules "default": minimum track width 6mil, minimum drill 0.35mm, track to track 6mil, track to pad 6mil, pad to pad 6mil, via to via 6mil, smd to smd 6mil, copper to edge 40mil, drill to drill 6mil, minimum pad ring 10mil, minimum via ring 8mil, stop-mask expansion 4mil, vias tented up to drill 0mil, thermal gap 10mil

### Footprints (pad centres in the part's own frame; a part is rotated, then mirrored left to right if it is on the bottom)
C0603 = smd 1.1 x 1: 1 -0.85,0; 2 0.85,0
C1206 = smd 1.6 x 1.8: 1 -1.4,0; 2 1.4,0
LED-0603 = smd 1 x 1: A -0.877,0; C 0.877,0
FUSE_HOLDER = drill 1.6: P$1 0,0; P$2 0,3.4; P$3 9.92,3.4; P$4 9.92,0
AVRISP = drill 0.9 pad 1.626: 1 -1.27,2.54; 2 1.27,2.54; 3 -1.27,0; 4 1.27,0; 5 -1.27,-2.54; 6 1.27,-2.54
1X03 = drill 1.016 pad 1.88: 1 0,0; 2 2.54,0; 3 5.08,0
2X3-NS = drill 1.016 pad 1.88: 1 -2.54,-1.27; 2 -2.54,1.27; 3 0,-1.27; 4 0,1.27; 5 2.54,-1.27; 6 2.54,1.27
MOLEX_503182-1852 = smd 0.8 x 1.24: 1 -2.9,6.355; 2 -1.8,6.355; 3 -0.7,6.355; 4 0.4,6.355; 5 1.5,6.355; 6 2.6,6.355; 7 3.7,6.355; 8 4.8,6.355 | smd 1.16 x 1.2: DT 6.74,-5.275 | smd 0.95 x 2.5: P1 -7.245,5.725 | smd 1.15 x 2.2: P2 7.145,5.875; P3 -7.145,-5.605 | smd 1.5 x 1.15: P4 -2.84,-6.4; P5 4.94,-6.4 | smd 1.16 x 1.25: SW 6.74,3.725
SCREWTERMINAL-5MM-3 = drill 1.3 pad 2.413 square: 1 0,0 | drill 1.3 pad 2.413: 2 5,0; 3 10,0
HC49UP = smd 5.334 x 1.93: 1 -4.826,0; 2 4.826,0
HC49/S = drill 0.813: 1 -2.413,0; 2 2.413,0
R0603 = smd 1 x 1.1: 1 -0.85,0; 2 0.85,0
0603 = smd 1.1 x 1: 1 -0.85,0; 2 0.85,0
TACTILE_SWITCH_SMD_5.2MM = smd 1.524 x 0.762: 1 -2.794,1.905; 2 2.794,1.905; 3 -2.794,-1.905; 4 2.794,-1.905
D2PAK/A = smd 0.991 x 3.912: 1 -2.54,-8.877; 3 2.54,-8.877 | smd 1.346 x 3.912: 2 0,-8.877 | smd 10.465 x 11.455: 4 0,0
TQFP100 = smd 1.5 x 0.3: 1 -8,6; 2 -8,5.5; 3 -8,5; 4 -8,4.5; 5 -8,4; 6 -8,3.5; 7 -8,3; 8 -8,2.5; 9 -8,2; 10 -8,1.5; 11 -8,1; 12 -8,0.5; 13 -8,0; 14 -8,-0.5; 15 -8,-1; 16 -8,-1.5; 17 -8,-2; 18 -8,-2.5; 19 -8,-3; 20 -8,-3.5; 21 -8,-4; 22 -8,-4.5; 23 -8,-5; 24 -8,-5.5; 25 -8,-6; 51 8,-6; 52 8,-5.5; 53 8,-5; 54 8,-4.5; 55 8,-4; 56 8,-3.5; 57 8,-3; 58 8,-2.5; 59 8,-2; 60 8,-1.5; 61 8,-1; 62 8,-0.5; 63 8,0; 64 8,0.5; 65 8,1; 66 8,1.5; 67 8,2; 68 8,2.5; 69 8,3; 70 8,3.5; 71 8,4; 72 8,4.5; 73 8,5; 74 8,5.5; 75 8,6 | smd 0.3 x 1.5: 26 -6,-8; 27 -5.5,-8; 28 -5,-8; 29 -4.5,-8; 30 -4,-8; 31 -3.5,-8; 32 -3,-8; 33 -2.5,-8; 34 -2,-8; 35 -1.5,-8; 36 -1,-8; 37 -0.5,-8; 38 0,-8; 39 0.5,-8; 40 1,-8; 41 1.5,-8; 42 2,-8; 43 2.5,-8; 44 3,-8; 45 3.5,-8; 46 4,-8; 47 4.5,-8; 48 5,-8; 49 5.5,-8; 50 6,-8; 76 6,8; 77 5.5,8; 78 5,8; 79 4.5,8; 80 4,8; 81 3.5,8; 82 3,8; 83 2.5,8; 84 2,8; 85 1.5,8; 86 1,8; 87 0.5,8; 88 0,8; 89 -0.5,8; 90 -1,8; 91 -1.5,8; 92 -2,8; 93 -2.5,8; 94 -3,8; 95 -3.5,8; 96 -4,8; 97 -4.5,8; 98 -5,8; 99 -5.5,8; 100 -6,8
PSON65P250X250X100-8N = smd 0.49 x 0.45: 1 0.97,0.975; 2 0.97,0.325; 3 0.97,-0.325; 4 0.97,-0.975; 5 -0.97,-0.975; 6 -0.97,-0.325; 7 -0.97,0.325; 8 -0.97,0.975
QFP32P80_900X900X120L60X37N = smd 1.6 x 0.55: 1 -4.18,2.8; 2 -4.18,2; 3 -4.18,1.2; 4 -4.18,0.4; 5 -4.18,-0.4; 6 -4.18,-1.2; 7 -4.18,-2; 8 -4.18,-2.8; 17 4.18,-2.8; 18 4.18,-2; 19 4.18,-1.2; 20 4.18,-0.4; 21 4.18,0.4; 22 4.18,1.2; 23 4.18,2; 24 4.18,2.8 | smd 0.55 x 1.6: 9 -2.8,-4.18; 10 -2,-4.18; 11 -1.2,-4.18; 12 -0.4,-4.18; 13 0.4,-4.18; 14 1.2,-4.18; 15 2,-4.18; 16 2.8,-4.18; 25 2.8,4.18; 26 2,4.18; 27 1.2,4.18; 28 0.4,4.18; 29 -0.4,4.18; 30 -1.2,4.18; 31 -2,4.18; 32 -2.8,4.18
PW20 = smd 1.676 x 0.356: 1 -2.819,2.925; 2 -2.819,2.275; 3 -2.819,1.625; 4 -2.819,0.975; 5 -2.819,0.325; 6 -2.819,-0.325; 7 -2.819,-0.975; 8 -2.819,-1.625; 9 -2.819,-2.275; 10 -2.819,-2.925; 11 2.819,-2.925; 12 2.819,-2.275; 13 2.819,-1.625; 14 2.819,-0.975; 15 2.819,-0.325; 16 2.819,0.325; 17 2.819,0.975; 18 2.819,1.625; 19 2.819,2.275; 20 2.819,2.925
DDC0006A_N = smd 1 x 0.6: 1 -1.375,0.95; 2 -1.375,0; 3 -1.375,-0.95; 4 1.375,-0.95; 5 1.375,0; 6 1.375,0.95
STANDOFF-HOLE = hole 3.9: 0,0
B6BEHALFSN = drill 0.8: X-1 2.5,2.2; X-2 5,2.2; X-3 7.5,2.2; X-4 10,2.2; X-5 12.5,2.2; X-6 15,2.2
NRF24L01+PA+LNA = drill 1.016 octagon: CE 21.59,-0.68; CSN 19.05,-0.68; GND 21.59,-3.22; IRQ 19.05,4.4; MISO 21.59,4.4; MOSI 19.05,1.86; SCK 21.59,1.86; VCC 19.05,-3.22
1751248 = drill 1.1 pad 1.7: 1 -1.75,-0.1; 2 1.75,-0.1
XAL6030 = smd 1.422 x 5.69: 1 -2.019,0; 2 2.019,0

### Placement (x,y rotation side)
C1  68.58,33.02 0 top
C2  73.66,33.02 0 top
C3  10.16,20.32 90 bottom
C4  74.93,80.01 0 top
C5  78.74,80.01 0 top
C6  82.55,80.01 0 top
C7  59.69,76.2 90 top
C8  59.69,60.96 270 top
C9  66.04,55.88 180 top
C10  10.16,69.85 90 top
C11  20.32,26.67 90 bottom
C12  20.32,22.86 270 bottom
C13  16.51,35.56 0 top
C14  34.29,40.64 0 top
C15  15.24,25.4 90 bottom
C16  15.24,33.02 270 bottom
C17  6.35,69.85 90 top
C18  44.7,23.37 0 top
C19  59.05,20.7 0 top
C20  13.97,58.42 270 top
C21  43.18,53.34 0 top
C22  43.18,55.88 0 top
C23  38.1,55.88 0 top
C24  38.1,53.34 0 top
C25  82.55,77.47 0 top
C26  2.54,69.85 90 top
C27  80.01,74.93 90 top
C28  44.45,66.04 0 top
C29  16.51,62.23 0 top
C30  5.08,76.2 90 top
C31  2.54,76.2 90 top
D1  48.26,76.2 0 top
FUSE  52.07,73.66 180 top
ISP1  16.51,41.91 180 top
J1  87.63,73.66 90 top
J2  87.63,64.77 90 top
J3  83.82,55.88 0 top
J4  10.16,10.16 0 top
J5  5.08,52.07 270 top
Q1  69.85,38.1 180 top
Q2  59.69,68.58 90 top
R1  78.74,33.02 0 top
R2  17.78,58.42 90 top
R3  71.12,63.5 270 top
R4  44.45,76.2 0 top
R5  53.34,64.77 270 top
R6  24.51,33.27 180 top
R7  73.66,63.5 270 top
R8  64.77,44.45 0 top
R9  64.64,31.62 0 top
R10  19.81,2.92 90 top
R11  10.16,76.2 180 top
R12  10.16,73.66 0 top
S1  13.97,52.07 270 top
S3  66.04,60.96 0 top
T2  7.62,29.21 90 top
U1  46.99,40.64 0 top
U2  24.13,24.13 0 top
U3  73.66,72.39 0 top
U4  26.67,38.1 0 top
U5  15.24,67.31 180 top
U6  52.07,22.86 0 top
U$1  [STANDOFF-HOLE]  21.88,52.25 0 top
U$2  [STANDOFF-HOLE]  38.63,22.62 0 top
U$3  [STANDOFF-HOLE]  68.38,24 0 top
U$4  [STANDOFF-HOLE]  71.38,52.88 0 top
X1  69.85,1.27 0 top
X3  44.45,10.16 180 top
X5  5.08,60.96 270 top
XAL6030-332MEB  20.32,72.39 90 top

### Tracks (layer width: path | path; a pad name or v marks a point on that pad's centre or on a via)
!RESET1  (via drill 0.35)
  Top 0.254: U1.30 42.92,32.57 42.92,31.77 41.62,30.48 v31.75,30.48 | v17.78,48.26 16.76,49.28 S1.2 S1.1 15.88,55.66 | 15.88,55.66 C20.2 | 15.88,55.66 R2.1
  Bottom 0.254: v31.75,30.48 29.21,30.48 27.94,29.21 25.4,29.21 20.32,34.29 | 20.32,34.29 19.05,35.56 19.05,43.18 ISP1.5 v17.78,48.26 | 20.32,34.29
+3V3  (via drill 0.35)
  Top 0.254: T2.2 v20.32,29.21 | U6.2 43.18,25.14 | 43.18,25.14 42.17,25.14 40.64,26.67 v31.75,26.67 | v10.54,17.91 10.54,16.53 J4.4 | 43.18,25.14 43.85,24.46 C18.1 | U4.2 23.66,40.18 22.9,40.18 18.44,35.72 18.44,34.02 17.78,33.36 v17.78,33.02
  Bottom 0.254: v20.32,29.21 v22.86,29.21 25.4,26.67 v31.75,26.67 | v19.81,20.19 21.08,20.19 21.21,20.32 21.46,20.32 v22.73,21.59 | C15.1 15.37,24.13 v17.78,24.13 | C3.1 10.54,19.09 v10.54,17.91 | C11.1 20.32,25.4 | 20.32,25.4 C12.1 | 20.32,25.4 22.1,23.62 v22.1,22.86 | v17.78,33.02 v20.32,33.02
  pour Top: 1.27,0 1.27,36.83 21.59,36.83 21.59,43.18 25.4,43.18 27.94,40.64 27.94,0
+5V  (via drill 0.35)
  Top 0.254: 2.54,74.93 C31.1 | 5.08,74.93 C30.1 | T2.3 16.51,31.76 16.51,39.37 | U1.10 40.41,42.14 v40.64,41.91 | C4.1 74.08,79.59 74.52,79.15 77.03,79.15 C5.1 | C19.1 58.42,20.49 v58.42,17.78
  Bottom 0.254: ISP1.2 C16.1 | v40.64,41.91 v40.64,39.37 | v58.42,17.78 52.07,17.78 45.72,11.43 v35.56,11.43
  pour Top: 0,82.55 0,67.31 12.7,67.31 12.7,38.1 20.32,38.1 20.32,44.45 25.4,44.45 29.21,40.64 29.21,0 90.17,0 90.17,81.28 90.17,82.55
+5V_FUSE  (via drill 0.35)
  Top 0.254: FUSE.P$1 FUSE.P$2 52.07,66.89 R5.1 | FUSE.P$1 56.9,78.49 62.23,78.49 66.04,74.68 66.04,72.77 | 69.41,71.12 U3.6 | 66.04,72.77 66.04,72.39 67.31,71.12 69.41,71.12 | U3.4 69.46,72.77 66.04,72.77 | 80.74,70.39 81.28,69.85 v82.55,69.85 | 80.74,70.39 80.74,71.85 J1.3 | R4.1 46.14,73.66 | 46.14,73.66 FUSE.P$1 | C28.1 46.14,68.58 46.14,73.66 | 80.74,70.39 U3.18 71.85,70.39 71.12,71.12 69.41,71.12
  Bottom 0.254: v82.55,69.85 J2.3
+12V
  Top 0.152: U5.5 15.24,67.31 16.19,68.26 U5.3
  Top 0.254: 5.08,67.31 5.08,62.81 X5.1 7.14,62.71 10.16,59.69 10.16,55.88 6.35,52.07 J5.1 | 6.35,67.31 C17.1 | 5.08,67.31 6.35,67.31 | 6.35,67.31 10.16,67.31 | 10.16,67.31 C10.1 | 10.16,67.31 U5.5 | 5.08,67.31 4.23,67.31 C26.1
  pour Top: 0,66.04 11.43,66.04 11.43,38.1 0,38.1
CE_3V3  (via drill 0.35)
  Top 0.254: U6.7 43.53,21.89 39.91,18.26 36.04,18.26 v33.02,15.24 | X3.CE 24.13,12.11 v24.13,15.24
  Bottom 0.254: v33.02,15.24 v24.13,15.24
CE_5V  (via drill 0.35)
  Top 0.254: v37.08,34.29 37.64,34.29 37.96,34.61 37.96,35.41 38.12,35.57 38.92,35.57 U1.23 | U6.14 53.81,21.89 53.34,22.35 53.34,24.13 50.8,26.67 44.45,26.67 41.91,29.21 v38.1,29.21
  Bottom 0.254: v37.08,34.29 37.08,30.23 v38.1,29.21
CON_CONNECTED
  Top 0.254: U1.73 66.04,45.64 | 66.04,45.64 72.47,45.64 85.09,33.02 85.09,3.71 X1.X-6 | R8.2 65.62,45.22 66.04,45.64
CURRENT_SENSOR
  Top 0.254: J5.2 26.75,47.07 30.48,50.8 48.26,50.8 49.02,50.04 49.02,48.67 U1.84
DATA3
  Top 0.254: R3.2 72.81,60.96 81.28,60.96 J2.2
DATA4
  Top 0.254: J1.2 86.36,76.2 83.82,73.66 83.82,68.58 77.89,62.65 R7.2
ENCODER_SENSE1  (via drill 0.35)
  Top 0.254: U1.82 49.99,49.99 52.07,52.07 54.61,52.07 57.15,49.53 v57.15,46.99
  Bottom 0.254: X1.X-1 72.35,30.52 57.15,45.72 v57.15,46.99
ENCODER_SENSE2  (via drill 0.35)
  Top 0.254: U1.83 49.49,50.06 51.9,52.48 54.78,52.48 57.81,49.45 57.81,47.24 v58.06,46.99
  Bottom 0.254: v58.06,46.99 74.85,30.2 X1.X-2
FAN_PWM
  Top 0.254: X1.X-3 77.35,28.06 76.2,29.21 58.42,29.21 44.99,42.64 U1.9
GND  (via drill 0.35)
  Top 0.254: C26.2 C17.2 | C17.2 C10.2 | C17.2 v6.35,73.66 R12.1 | C31.2 3.81,78.32 | 3.81,78.32 v3.81,78.74 | C30.2 3.81,78.32 | 15.24,3.9 J4.P5 11.48,3.76 v10.16,5.08 8.84,3.76 J4.P4 3.81,3.76 J4.P3 2.92,4.66 J4.P1 | 15.24,3.9 15.24,5.08 17.76,7.6 17.76,14.63 17.3,15.08 J4.P2 17.3,16.98 v16.51,17.78 | J4.6 12.76,17.84 v13.34,18.41 | v10.16,48.26 11.18,49.28 S1.4 S1.3 v12.06,56.52 12.06,57.37 C20.1 | 66.04,62.87 S3.1 62.45,62.87 C8.2 | 66.04,62.87 S3.2 | 66.04,62.87 v66.04,64.77 | C9.2 v63.5,55.88 | U2.1 24.47,25.74 | 24.47,25.74 24.13,26.07 v24.13,26.67 | 24.47,25.74 23.68,24.95 23.68,24.8 23.34,24.45 U2.7 | U6.11 56.27,19.93 v57.15,19.05 | 15.24,3.9 17.07,2.07 R10.1 | X3.GND v22.86,15.24 | U4.11 29.49,35.13 v30.33,34.29 | C23.2 39.37,55.88 40.64,54.61 | C24.2 39.37,53.34 40.64,54.61 | 40.64,54.61 42.76,54.61 | 42.76,54.61 C21.2 44.45,53.34 v45.72,54.61 44.45,55.88 C22.2 42.76,54.61 | C4.2 76.44,80.01 77.22,80.79 78.56,80.79 79.33,80.01 C5.2 80.25,80.01 81.03,80.79 82.37,80.79 83.14,80.01 C6.2 C25.2 83.4,77.05 v82.55,76.2 80.43,76.2 C27.2 | D1.C v50.8,76.2 | R8.1 v62.23,44.45 | R9.1 63.79,30.77 v63.5,30.48 | R6.1 25.4,33.23 v25.4,31.75 | C1.2 70.71,31.74 v72.38,31.74 73.23,31.74 C2.2 | C14.2 v36.83,40.64 37.83,41.64 U1.11 | C13.2 17.36,34.71 v17.78,34.29 | C19.2 v61.34,20.7 | C18.2 v46.86,23.37 | C7.2 60.54,77.05 v60.96,77.47 | C28.2 v46.99,66.04 | U3.3 69.55,73.66 v71.12,73.66 | U3.5 71.1,71.99 v71.12,72.01 | U3.21 76.47,72.79 v76.45,72.77 | U1.32 43.99,33.83 v44.45,34.29 | U1.62 53.84,40.14 v53.34,40.64 | U1.81 50.56,48.57 50.56,46.75 v49.53,45.72 | U5.1 17.97,66.36 v18.03,66.29 | T2.1 17.77,25.4 v17.78,25.4 | U1.99 U1.98 41.99,47.07 v41.91,46.99 41.49,47.41 U1.99
  pour Bottom: -1.27,82.55 91.44,82.55 91.44,-1.27 -1.27,-1.27
IRQ_3V3  (via drill 0.35)
  Top 0.254: X3.IRQ 29.21,9.57 v29.21,13.97 | v33.02,13.97 40.64,13.97 47.91,21.23 U6.8
  Bottom 0.254: v29.21,13.97 v33.02,13.97
IRQ_5V  (via drill 0.35)
  Top 0.254: U6.13 55.08,21.43 55.84,21.43 59.69,25.27 v59.69,27.94 | v59.69,30.48 59.69,40.64 56.69,43.64 U1.69
  Bottom 0.254: v59.69,27.94 v59.69,30.48
LED_RX_5V  (via drill 0.35)
  Top 0.254: U3.30 72.39,76.64 v72.39,79.51 | U1.3 37.42,45.64 34.29,48.77 v34.29,49.53
  Bottom 0.254: v72.39,79.51 72.14,79.76 66.04,79.76 41.66,79.76 34.29,72.39 v34.29,49.53
LED_TX_5V  (via drill 0.35)
  Top 0.254: U3.31 71.66,78.2 v71.12,78.74 | U1.2 37.81,46.14 35.56,48.39 v35.56,49.53
  Bottom 0.254: v35.56,49.53 35.56,72.39 41.91,78.74 v71.12,78.74
LOGIC_RX_3V3
  Top 0.254: X1.X-5 80.15,1.27 71.12,1.27 50.8,21.59 50.8,24.13 50.45,24.48 U6.3
LOGIC_RX_5V  (via drill 0.35)
  Top 0.254: U6.18 56.23,24.48 v57.15,25.4 | v41.91,41.91 41.15,41.15 U1.12
  Bottom 0.254: v57.15,25.4 58.42,26.67 58.42,27.94 57.15,29.21 44.45,41.91 v41.91,41.91
LOGIC_TX_3V3
  Top 0.254: X1.X-4 78.92,2.54 70.88,2.54 51.21,22.21 51.21,24.99 50.41,25.79 U6.1
LOGIC_TX_5V  (via drill 0.35)
  Top 0.254: U6.20 56.27,25.79 v57.15,26.67 | v41.91,40.64 U1.13
  Bottom 0.254: v57.15,26.67 57.15,27.94 44.45,40.64 v41.91,40.64
LS_EN  (via drill 0.35)
  Top 0.254: U6.10 48.37,19.05 v48.26,19.05 | v25.4,27.94 23.85,29.49 23.85,33.02 23.85,33.08 | 23.85,33.08 U4.10 | U1.71 56.03,44.64 v56.27,44.4 | R9.2 64.1,33.02 v62.23,33.02 | R6.2 23.85,33.08
  Bottom 0.254: v25.4,27.94 40.64,27.94 46.99,21.59 46.99,20.32 v48.26,19.05 55.88,19.05 62.23,25.4 62.23,31.75 | 62.23,31.75 57.15,36.83 57.15,43.52 v56.27,44.4 | v62.23,33.02 62.23,31.75
MISO  (via drill 0.35)
  Top 0.254: U3.15 75.66,64.04 v76.2,63.5
  Bottom 0.254: v76.2,63.5 76.2,59.69 J3.1
MISO1_3V3  (via drill 0.35)
  Top 0.254: 30.23,24.13 30.23,8.89 25.91,4.57 24.64,4.57 23.45,5.76 X3.MISO 20.91,5.76 19.05,7.62 19.05,17.78 17.78,19.05 15.24,19.05 13.97,17.78 13.97,16.62 J4.7 | 30.23,24.13 30.23,30.73 27.94,33.02 27.94,35.56 27.71,35.79 27.67,35.79 27.28,36.18 27.28,36.22 25.07,38.42 U4.5 | U2.5 23.31,23.3 23.49,23.3 24.13,23.94 v24.13,24.13 | v29.21,24.13 30.23,24.13
  Bottom 0.254: v24.13,24.13 v29.21,24.13
MISO1_5V  (via drill 0.35)
  Top 0.254: v31.75,38.1 31.43,38.42 U4.16 28.73,38.42 27.94,39.21 27.94,40.64 25.4,43.18 17.5,43.18 16.51,42.19 16.51,40.64 ISP1.1 | v31.75,36.48 31.75,35.21 32.09,34.87 36.45,34.87 37.72,36.14 U1.22
  Bottom 0.254: v31.75,38.1 v31.75,36.48
MOSI  (via drill 0.35)
  Top 0.254: U3.16 76.46,64.51 v77.47,63.5
  Bottom 0.254: v77.47,63.5 J3.4
MOSI1_3V3  (via drill 0.35)
  Top 0.254: v27.94,30.48 27.94,10.84 X3.MOSI 24.97,8.3 23.88,9.4 22.35,9.4 21.59,10.16 21.59,20.32 | v25.4,39.37 25.11,39.08 U4.4 | J4.3 9.46,18.35 12.7,21.59 20.32,21.59 21.59,20.32 | U2.3 24.95,23.66 24.77,23.66 23.39,22.28 23.39,21.32 22.39,20.32 21.59,20.32
  Bottom 0.254: v25.4,39.37 26.26,38.51 26.26,37.2 27.94,35.52 v27.94,30.48
MOSI1_5V  (via drill 0.35)
  Top 0.254: U4.17 v31.74,39.08 v31.75,39.07 | U1.21 34.48,36.64 34.29,36.45 v33.02,36.45 | ISP1.4 16.51,43.18 16.51,44.73 17.5,45.72 24.13,45.72 27.94,41.91 v31.75,41.91
  Bottom 0.254: v33.02,36.45 33.02,37.8 v31.75,39.07 v31.75,41.91
N$1
  Top 0.254: C2.1 72.81,36.23 Q1.1 77.89,34.89 R1.1
N$2  (via drill 0.35)
  Top 0.254: Q1.2 65.02,35.73 C1.1 67.31,32.6 v67.31,30.48 | U1.33 44.49,31.71 48.26,27.94 58.76,27.94 59.42,28.6 61.23,28.6 61.89,27.94 v63.5,27.94
  Bottom 0.254: v63.5,27.94 66.04,27.94 67.31,29.21 v67.31,30.48
N$3  (via drill 0.35)
  Top 0.254: v57.15,31.75 57.49,31.75 59.42,29.82 76.39,29.82 R1.2 | U1.34 44.99,31.84 45.22,31.61 45.86,31.61 46.99,30.48 v49.53,30.48
  Bottom 0.254: v57.15,31.75 57.15,29.79 58.83,28.11 58.83,26.15 57.42,24.74 56.88,24.74 51.14,30.48 v49.53,30.48
N$4
  Top 0.254: R4.2 D1.A
N$7
  Top 0.254: C29.2 19.05,63.92 19.05,67.31 | 19.05,67.31 U5.2 | 19.05,67.31 20.32,68.58 XAL6030-332MEB.1
N$8
  Top 0.254: U5.6 13.97,66.25 13.97,62.23 C29.1
N$9
  Top 0.254: R12.2 12.7,73.66 | 12.7,73.66 R11.1 | U5.4 13.87,69.95 12.7,71.12 12.7,73.66
N$23
  Top 0.254: U3.20 78.42,71.99 80.01,73.58 C27.1
NP1
  Top 0.254: U3.10 71.66,66.35 R7.1
NP2
  Top 0.254: U3.9 70.86,64.61 R3.1
RST  (via drill 0.35)
  Top 0.254: v87.59,60.96 87.59,55.84 J3.5 83.82,52.07 78.74,52.07 71.75,59.05 S3.4 | v80.01,78.74 73.66,78.74 73.26,78.34 U3.29 | S3.4 S3.3 58.2,59.05 R5.2 | C9.1 68.83,57.82 S3.4
  Bottom 0.254: v87.59,60.96 80.01,68.54 v80.01,78.74
SCK  (via drill 0.35)
  Top 0.254: v80.01,67.31 77.84,69.48 U3.17
  Bottom 0.254: J3.3 83.82,55.43 85.04,56.65 85.04,62.28 v80.01,67.31
SCK1_3V3  (via drill 0.35)
  Top 0.254: J4.5 11.66,18.01 13.34,19.68 18.03,19.68 | 18.03,19.68 19.56,18.16 | 19.56,18.16 19.56,10.29 21.55,8.3 X3.SCK | U2.4 25.1,20.02 v24.13,19.05 | v20.32,19.05 19.56,18.29 19.56,18.16 | v19.05,30.48 19.05,33.74 22.5,37.19 22.9,37.58 23.09,37.77 U4.6 | v18.9,20.32 18.27,19.68 18.03,19.68
  Bottom 0.254: v24.13,19.05 v20.32,19.05 | v19.05,30.48 19.05,20.47 v18.9,20.32
SCK1_5V
  Top 0.254: U1.20 31.57,37.14 30.93,37.77 U4.15 28.45,37.77 28.21,38.02 27.67,38.02 27.43,37.77 27.25,37.77 26.67,38.35 26.67,39.37 26.67,40.64 25.4,41.91 ISP1.3
SD_DETECT_3V3
  Top 0.254: U6.9 48.49,20.59 31.71,3.81 19.77,3.81 | J4.DT 17.98,3.81 19.77,3.81 | R10.2 19.77,3.81
SD_DETECT_5V  (via drill 0.35)
  Top 0.254: U6.12 55.08,20.78 55.84,20.78 60.96,25.89 v60.96,27.94 | v60.96,30.48 60.96,40.64 56.46,45.14 U1.72
  Bottom 0.254: v60.96,27.94 v60.96,30.48
SS0_3V3
  Top 0.254: J4.2 8.36,19.79 11.43,22.86 20.32,22.86 21.59,24.13 21.59,34.33 23.09,35.83 U4.9
SS0_5V
  Top 0.254: U1.19 40.21,37.64 40.26,37.59 40.26,33.78 39.75,33.27 31.62,33.27 30.99,33.91 30.99,35.43 30.6,35.83 U4.12
SS1_3V3
  Top 0.254: U2.2 25.73,24.45 26.26,24.99 26.26,34.82 24.61,36.48 U4.8
SS1_5V  (via drill 0.35)
  Top 0.254: U4.13 27.97,36.48 v27.94,36.45 | U1.78 51.99,50.72 v52.07,50.8
  Bottom 0.254: v27.94,36.45 27.69,36.7 27.67,36.7 26.67,37.7 26.67,41.91 29.21,44.45 45.72,44.45 v52.07,50.8
SS2_3V3
  Top 0.254: X3.CSN 26.67,12.11 26.67,35.56 25.15,37.08 23.89,37.08 U4.7
SS2_5V  (via drill 0.35)
  Top 0.254: U4.14 28.17,37.12 v27.94,37.36 | U1.77 52.49,49.95 v53.34,50.8
  Bottom 0.254: v27.94,37.36 27.94,41.91 29.21,43.18 31.75,43.18 32.61,44.04 46.24,44.04 53,50.8 v53.34,50.8
XTAL3
  Top 0.254: Q2.2 C7.1 64.65,70.39 U3.7
XTAL4
  Top 0.254: Q2.1 C8.1 67.47,69.59 U3.8